# EAGLE design RPI_SSD1963 (EAGLE 6.3)
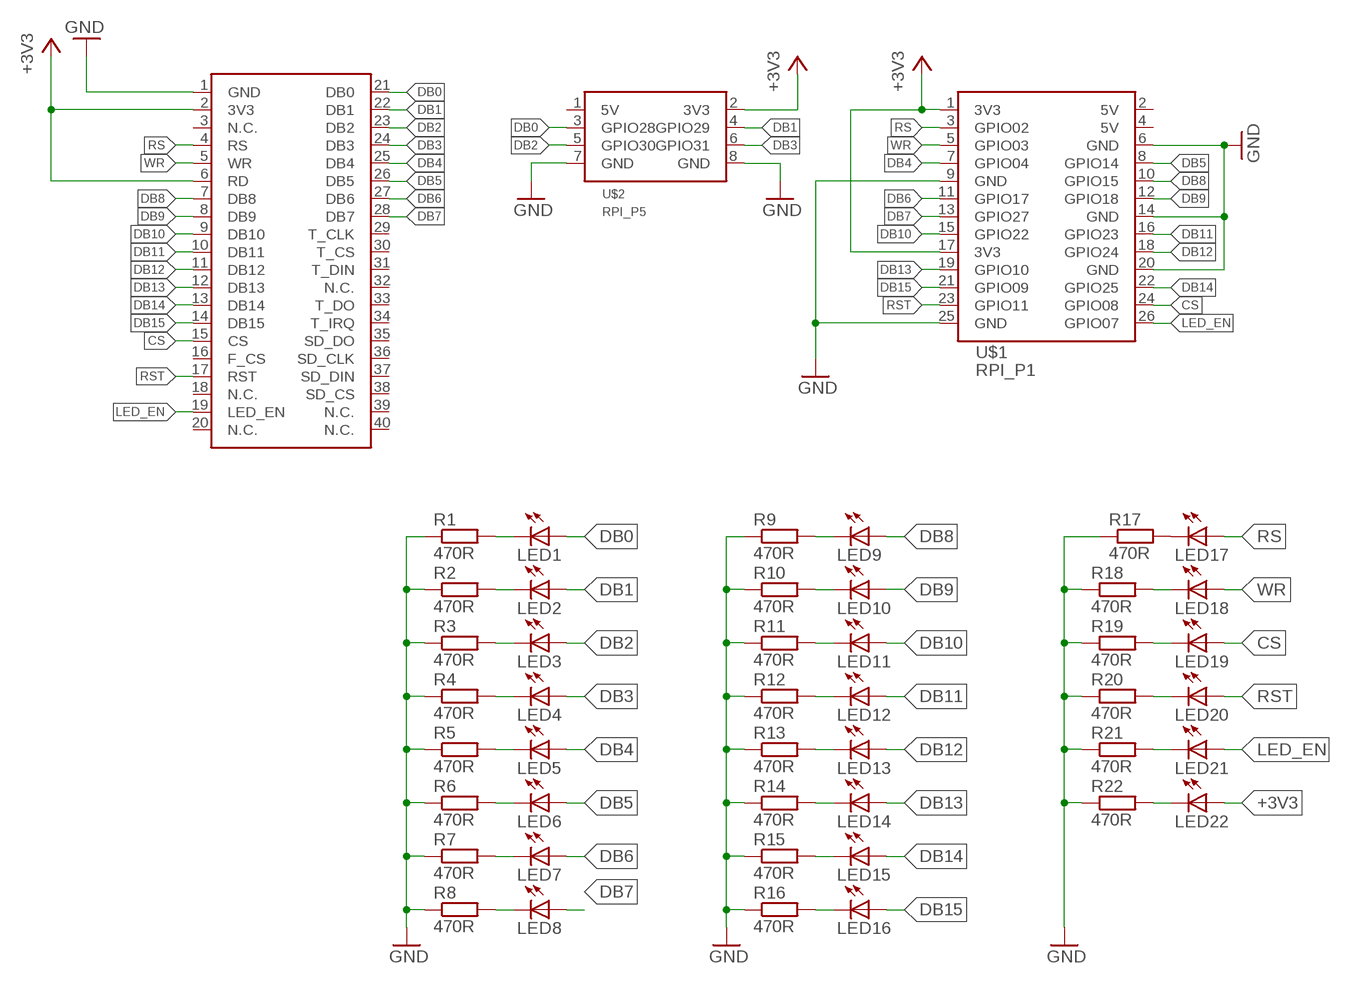
[diagram p0: schematic, sheet 1]

## Parts
LED1  LEDCHIP-LED0603  [CHIP-LED0603]
LED2  LEDCHIP-LED0603  [CHIP-LED0603]
LED3  LEDCHIP-LED0603  [CHIP-LED0603]
LED4  LEDCHIP-LED0603  [CHIP-LED0603]
LED5  LEDCHIP-LED0603  [CHIP-LED0603]
LED6  LEDCHIP-LED0603  [CHIP-LED0603]
LED7  LEDCHIP-LED0603  [CHIP-LED0603]
LED8  LEDCHIP-LED0603  [CHIP-LED0603]
LED9  LEDCHIP-LED0603  [CHIP-LED0603]
LED10  LEDCHIP-LED0603  [CHIP-LED0603]
LED11  LEDCHIP-LED0603  [CHIP-LED0603]
LED12  LEDCHIP-LED0603  [CHIP-LED0603]
LED13  LEDCHIP-LED0603  [CHIP-LED0603]
LED14  LEDCHIP-LED0603  [CHIP-LED0603]
LED15  LEDCHIP-LED0603  [CHIP-LED0603]
LED16  LEDCHIP-LED0603  [CHIP-LED0603]
LED17  LEDCHIP-LED0603  [CHIP-LED0603]
LED18  LEDCHIP-LED0603  [CHIP-LED0603]
LED19  LEDCHIP-LED0603  [CHIP-LED0603]
LED20  LEDCHIP-LED0603  [CHIP-LED0603]
LED21  LEDCHIP-LED0603  [CHIP-LED0603]
LED22  LEDCHIP-LED0603  [CHIP-LED0603]
R1  470R  R-EU_R0402  [R0402]
R2  470R  R-EU_R0402  [R0402]
R3  470R  R-EU_R0402  [R0402]
R4  470R  R-EU_R0402  [R0402]
R5  470R  R-EU_R0402  [R0402]
R6  470R  R-EU_R0402  [R0402]
R7  470R  R-EU_R0402  [R0402]
R8  470R  R-EU_R0402  [R0402]
R9  470R  R-EU_R0402  [R0402]
R10  470R  R-EU_R0402  [R0402]
R11  470R  R-EU_R0402  [R0402]
R12  470R  R-EU_R0402  [R0402]
R13  470R  R-EU_R0402  [R0402]
R14  470R  R-EU_R0402  [R0402]
R15  470R  R-EU_R0402  [R0402]
R16  470R  R-EU_R0402  [R0402]
R17  470R  R-EU_R0402  [R0402]
R18  470R  R-EU_R0402  [R0402]
R19  470R  R-EU_R0402  [R0402]
R20  470R  R-EU_R0402  [R0402]
R21  470R  R-EU_R0402  [R0402]
R22  470R  R-EU_R0402  [R0402]
U$1  RPI_P1  [RPI_P1]
U$2  RPI_P5  [RPI_P5]
U$3  SSD1963  [SSD1963]

## Nets
+3V3: LED22.A U$1.1(3V3) U$1.17(3V3) U$2.2(3V3) U$3.2(3V3) U$3.6(RD)
CS: LED19.A U$1.24(GPIO08) U$3.15(CS)
DB0: LED1.A U$2.3(GPIO28) U$3.21(DB0)
DB1: LED2.A U$2.4(GPIO29) U$3.22(DB1)
DB2: LED3.A U$2.5(GPIO30) U$3.23(DB2)
DB3: LED4.A U$2.6(GPIO31) U$3.24(DB3)
DB4: LED5.A U$1.7(GPIO04) U$3.25(DB4)
DB5: LED6.A U$1.8(GPIO14) U$3.26(DB5)
DB6: LED7.A U$1.11(GPIO17) U$3.27(DB6)
DB7: LED8.A U$1.13(GPIO27) U$3.28(DB7)
DB8: LED9.A U$1.10(GPIO15) U$3.7(DB8)
DB9: LED10.A U$1.12(GPIO18) U$3.8(DB9)
DB10: LED11.A U$1.15(GPIO22) U$3.9(DB10)
DB11: LED12.A U$1.16(GPIO23) U$3.10(DB11)
DB12: LED13.A U$1.18(GPIO24) U$3.11(DB12)
DB13: LED14.A U$1.19(GPIO10) U$3.12(DB13)
DB14: LED15.A U$1.22(GPIO25) U$3.13(DB14)
DB15: LED16.A U$1.21(GPIO09) U$3.14(DB15)
GND: R1.1 R2.1 R3.1 R4.1 R5.1 R6.1 R7.1 R8.1 R9.1 R10.1 R11.1 R12.1 R13.1 R14.1 R15.1 R16.1 R17.1 R18.1 R19.1 R20.1 R21.1 R22.1 U$1.6(GND) U$1.9(GND) U$1.14(GND) U$1.20(GND) U$1.25(GND) U$2.7(GND) U$2.8(GND) U$3.1(GND)
LED_EN: LED21.A U$1.26(GPIO07) U$3.19(LED_EN)
N$1: LED1.C R1.2
N$2: LED2.C R2.2
N$3: LED3.C R3.2
N$4: LED4.C R4.2
N$5: LED5.C R5.2
N$6: LED6.C R6.2
N$7: LED7.C R7.2
N$8: LED8.C R8.2
N$9: LED9.C R9.2
N$10: LED10.C R10.2
N$11: LED11.C R11.2
N$12: LED12.C R12.2
N$13: LED13.C R13.2
N$14: LED14.C R14.2
N$15: LED15.C R15.2
N$16: LED16.C R16.2
N$18: LED17.C R17.2
N$19: LED18.C R18.2
N$20: LED19.C R19.2
N$21: LED20.C R20.2
N$22: LED21.C R21.2
N$23: LED22.C R22.2
RS: LED17.A U$1.3(GPIO02) U$3.4(RS)
RST: LED20.A U$1.23(GPIO11) U$3.17(RST)
WR: LED18.A U$1.5(GPIO03) U$3.5(WR)
Unconnected: U$1.2(5V) U$1.4(5V) U$2.1(5V) U$3.3(N.C.) U$3.16(F_CS) U$3.18(N.C.) U$3.20(N.C.) U$3.29(T_CLK) U$3.30(T_CS) U$3.31(T_DIN) U$3.32(N.C.) U$3.33(T_DO) U$3.34(T_IRQ) U$3.35(SD_DO) U$3.36(SD_CLK) U$3.37(SD_DIN) U$3.38(SD_CS) U$3.39(N.C.) U$3.40(N.C.)

## Library data of the parts
LED1-LED22 = led:LED: LED OSRAM: - CHIPLED LG R971, LG N971, LY N971, LG Q971, LY Q971, LO R971, LY R971 LH N974, LH R974 LS Q976, LO Q976, LY Q976 LO Q996 - Hyper CHIPLED LW Q18S LB Q993, LB Q99A, LB R99A - SideLED LS A670, LO A670, LY A670, LG A670, LP A670 LB A673, LV A673, LT A673, LW A673 LH A674 LY A675 LS A676, LA A676, LO A676, LY A676, LW A676 LS A679, LY A679, LG A679 - Hyper Micro SIDELED® LS Y876, LA Y876, LO Y876, LY Y876 LT Y87S - SmartLED LW L88C, LW L88S LB L89C, LB L89S, LG L890 LS L89K, LO L89K, LY L89K LS L896, LA L896, LO L896, LY L896 - TOPLED LS T670, LO T670, LY T670, LG T670, LP T670 LSG T670, LSP T670, LSY T670, LOP T670, LYG T670 LG T671, LOG T671, LSG T671 LB T673, LV T673, LT T673, LW T673 LH T674 LS T676, LA T676, LO T676, LY T676, LB T676, LH T676, LSB T676, LW T676 LB T67C, LV T67C, LT T67C, LS T67K, LO T67K, LY T67K, LW E67C LS E67B, LA E67B, LO E67B, LY E67B, LB E67C, LV E67C, LT E67C LW T67C LS T679, LY T679, LG T679 LS T770, LO T770, LY T770, LG T770, LP T770 LB T773, LV T773, LT T773, LW T773 LH T774 LS E675, LA E675, LY E675, LS T675 LS T776, LA T776, LO T776, LY T776, LB T776 LHGB T686 LT T68C, LB T68C - Hyper Mini TOPLED® LB M676 - Mini TOPLED Santana® LG M470 LS M47K, LO M47K, LY M47K Source: http://www.osram.convergy.de LUXEON: - LUMILED® LXK2-PW12-R00, LXK2-PW12-S00, LXK2-PW14-U00, LXK2-PW14-V00 LXK2-PM12-R00, LXK2-PM12-S00, LXK2-PM14-U00 LXK2-PE12-Q00, LXK2-PE12-R00, LXK2-PE12-S00, LXK2-PE14-T00, LXK2-PE14-U00 LXK2-PB12-K00, LXK2-PB12-L00, LXK2-PB12-M00, LXK2-PB14-N00, LXK2-PB14-P00, LXK2-PB14-Q00 LXK2-PR12-L00, LXK2-PR12-M00, LXK2-PR14-Q00, LXK2-PR14-R00 LXK2-PD12-Q00, LXK2-PD12-R00, LXK2-PD12-S00 LXK2-PH12-R00, LXK2-PH12-S00 LXK2-PL12-P00, LXK2-PL12-Q00, LXK2-PL12-R00 Source: www.luxeon.com KINGBRIGHT: KA-3528ASYC Source: www.kingbright.com
R1-R22 = rcl:R-EU_: RESISTOR, European symbol
U$1 = raspberryPi:RPI_P1
U$2 = raspberryPi:RPI_P5
U$3 = SSD1963:SSD1963

## Board
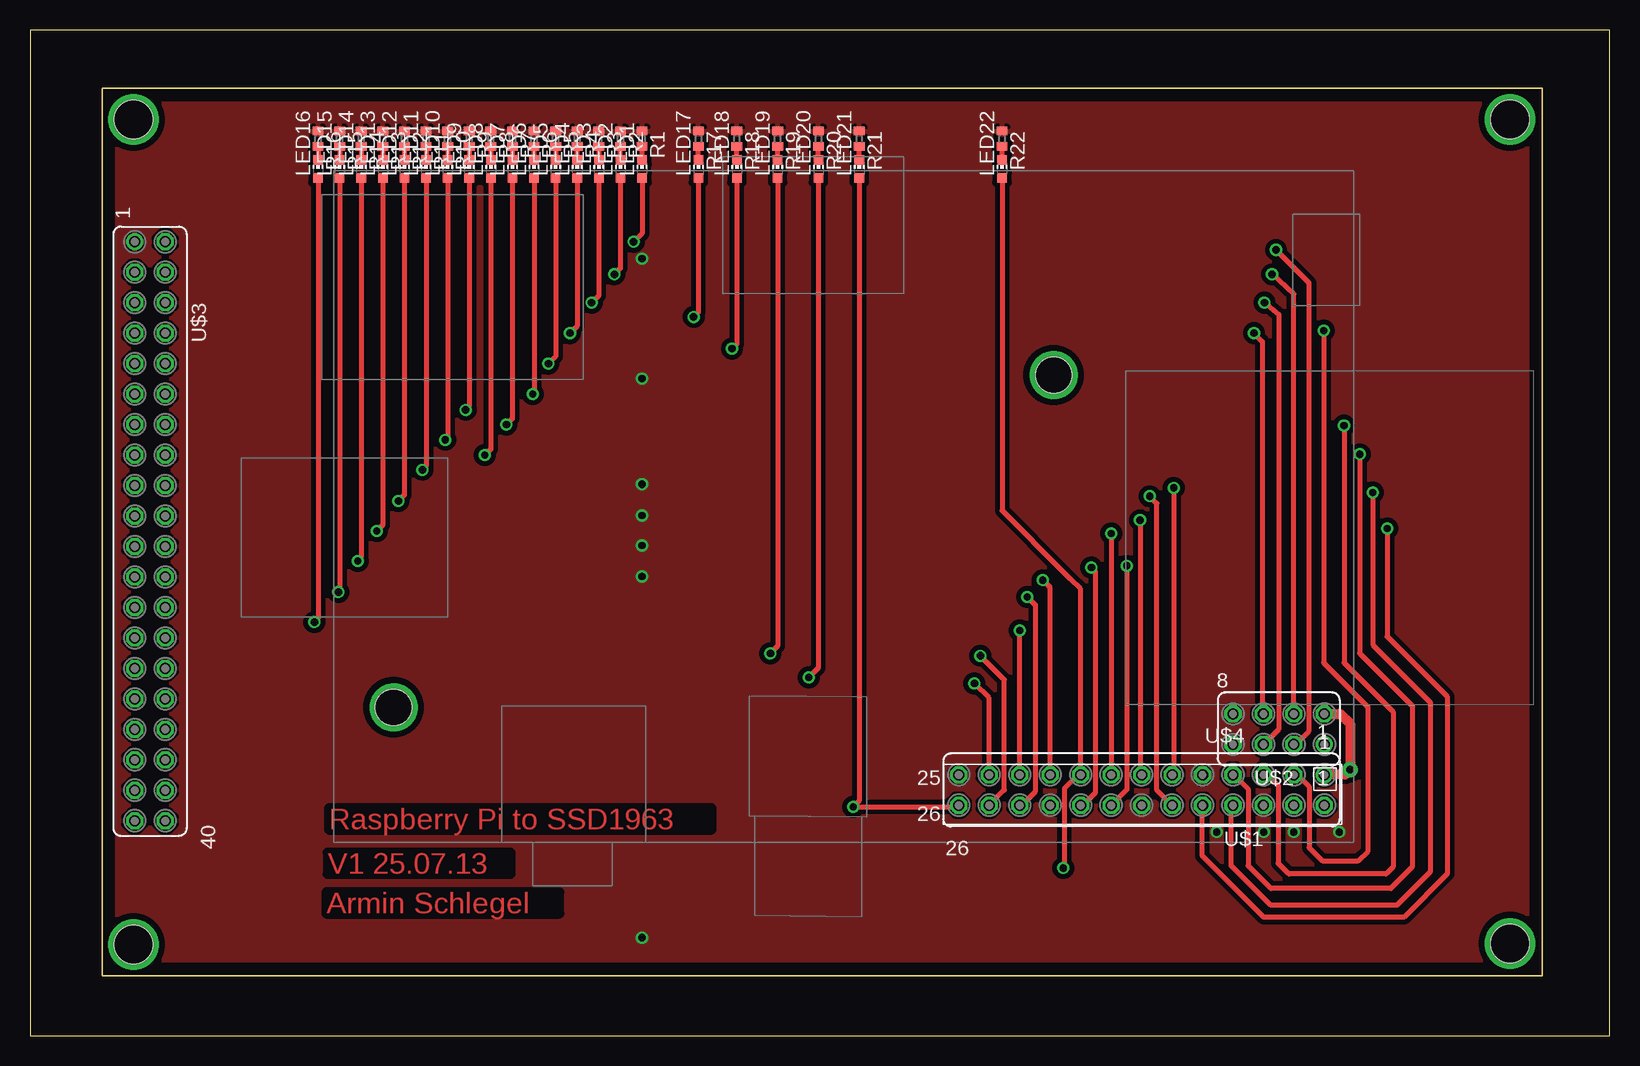
[diagram p1: board, top side]
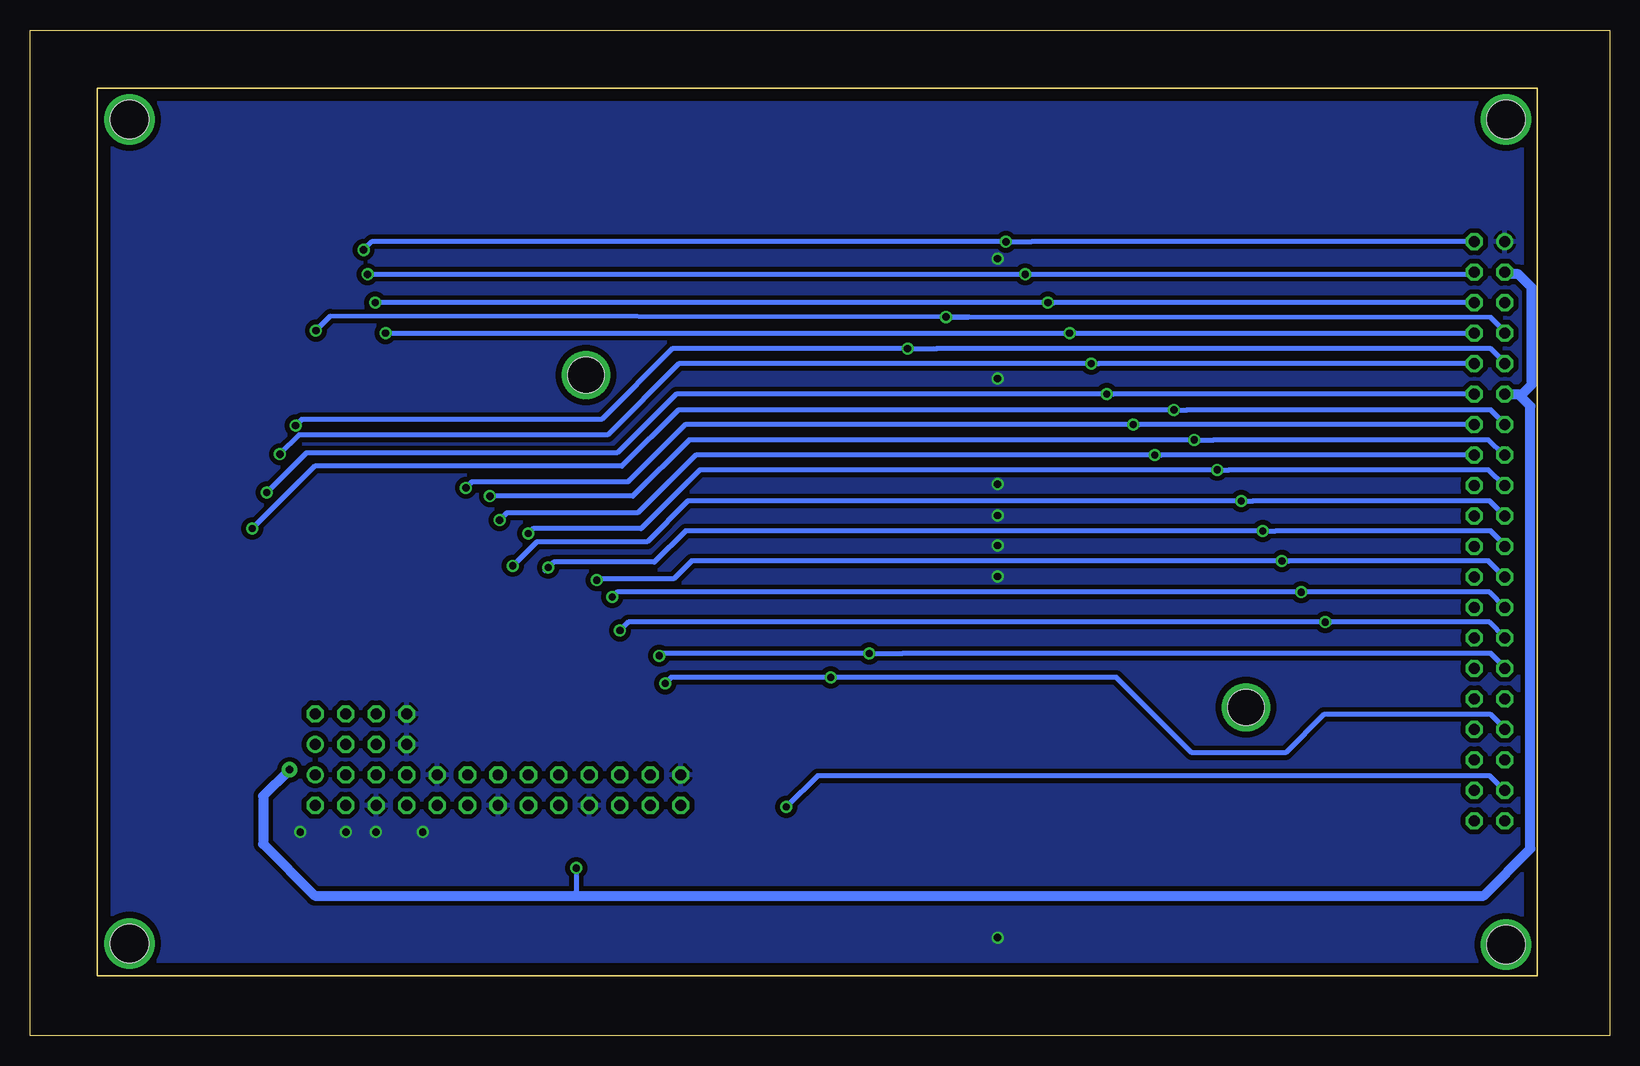
[diagram p2: board, bottom side, seen from below]

Size 131.63 x 83.87 mm. Coordinates in mm from the lower left corner, seen from the top.
Outline: 0,0 131.63,0 131.63,83.87 0,83.87 0,0
Copper layers (1*16): Top 0.035mm / dielectric 1.5mm / Bottom 0.035mm
Design rules "default": minimum track width 10mil, minimum drill 24mil, track to track 8mil, track to pad 8mil, pad to pad 8mil, via to via 8mil, smd to smd 8mil, copper to edge 40mil, drill to drill 8mil, minimum pad ring 10mil, minimum via ring 8mil, stop-mask expansion 4mil, vias tented up to drill 0mil, thermal gap 10mil

### Footprints (pad centres in the part's own frame; a part is rotated, then mirrored left to right if it is on the bottom)
CHIP-LED0603 = smd 0.8 x 0.8: A 0,-0.75; C 0,0.75
R0402 = smd 0.7 x 0.9: 1 -0.65,0; 2 0.65,0
RPI_P1 = drill 0.914: 1 -13.97,-1.27 | drill 0.914 octagon: 2 -13.97,1.27; 3 -11.43,-1.27; 4 -11.43,1.27; 5 -8.89,-1.27; 6 -8.89,1.27; 7 -6.35,-1.27; 8 -6.35,1.27; 9 -3.81,-1.27; 10 -3.81,1.27; 11 -1.27,-1.27; 12 -1.27,1.27; 13 1.27,-1.27; 14 1.27,1.27; 15 3.81,-1.27; 16 3.81,1.27; 17 6.35,-1.27; 18 6.35,1.27; 19 8.89,-1.27; 20 8.89,1.27; 21 11.43,-1.27; 22 11.43,1.27; 23 13.97,-1.27; 24 13.97,1.27; 25 16.51,-1.27; 26 16.51,1.27
RPI_P5 = drill 0.914: 1 -3.81,1.27 | drill 0.914 octagon: 2 -3.81,-1.27; 3 -1.27,1.27; 4 -1.27,-1.27; 5 1.27,1.27; 6 1.27,-1.27; 7 3.81,1.27; 8 3.81,-1.27
SSD1963 = drill 0.914: 1 2.7,61.19 | drill 0.914 octagon: 2 2.7,58.65; 3 2.7,56.11; 4 2.7,53.57; 5 2.7,51.03; 6 2.7,48.49; 7 2.7,45.95; 8 2.7,43.41; 9 2.7,40.87; 10 2.7,38.33; 11 2.7,35.79; 12 2.7,33.25; 13 2.7,30.71; 14 2.7,28.17; 15 2.7,25.63; 16 2.7,23.09; 17 2.7,20.55; 18 2.7,18.01; 19 2.7,15.47; 20 2.7,12.93; 21 5.24,61.19; 22 5.24,58.65; 23 5.24,56.11; 24 5.24,53.57; 25 5.24,51.03; 26 5.24,48.49; 27 5.24,45.95; 28 5.24,43.41; 29 5.24,40.87; 30 5.24,38.33; 31 5.24,35.79; 32 5.24,33.25; 33 5.24,30.71; 34 5.24,28.17; 35 5.24,25.63; 36 5.24,23.09; 37 5.24,20.55; 38 5.24,18.01; 39 5.24,15.47; 40 5.24,12.93 | drill 3.2: P$1 2.6,71.4; P$2 2.6,2.6; P$3 117.3,2.7; P$4 117.3,71.4 | hole 3.2: 117.3,71.4; 117.3,2.7; 2.6,2.6; 2.6,71.4
RASP_OUTLINE = drill 3: P$1 -19.3,-12.1; P$2 35.7,15.6 | hole 3: 35.7,15.6; -19.3,-12.1

### Placement (x,y rotation side)
LED1  51,72.3 0 top
LED2  49.2,72.3 0 top
LED3  47.4,72.3 0 top
LED4  45.6,72.3 0 top
LED5  43.8,72.3 0 top
LED6  42,72.3 0 top
LED7  40.2,72.3 0 top
LED8  38.4,72.3 0 top
LED9  36.6,72.3 0 top
LED10  34.8,72.3 0 top
LED11  33,72.3 0 top
LED12  31.2,72.3 0 top
LED13  29.4,72.3 0 top
LED14  27.6,72.3 0 top
LED15  25.8,72.3 0 top
LED16  24,72.3 0 top
LED17  55.7,72.3 0 top
LED18  58.9,72.3 0 top
LED19  62.3,72.3 0 top
LED20  65.7,72.3 0 top
LED21  69.1,72.3 0 top
LED22  81,72.3 0 top
R1  51,74.8 270 top
R2  49.2,74.8 270 top
R3  47.4,74.8 270 top
R4  45.6,74.8 270 top
R5  43.8,74.8 270 top
R6  42,74.8 270 top
R7  40.2,74.8 270 top
R8  38.4,74.8 270 top
R9  36.6,74.8 270 top
R10  34.8,74.8 270 top
R11  33,74.8 270 top
R12  31.2,74.8 270 top
R13  29.4,74.8 270 top
R14  27.6,74.8 270 top
R15  25.8,74.8 270 top
R16  24,74.8 270 top
R17  55.7,74.8 270 top
R18  58.9,74.8 270 top
R19  62.3,74.8 270 top
R20  65.7,74.8 270 top
R21  69.1,74.8 270 top
R22  81,74.8 270 top
U$1  93.9,20.51 180 top
U$2  104.06,25.59 180 top
U$3  6.03,5.02 0 top
U$4  RPI_OUTLINE  [RASP_OUTLINE]  66,43 180 top

### Tracks (layer width: path | path; a pad name or v marks a point on that pad's centre or on a via)
+3V3  (via drill 0.6, 0.6 pad 1.27)
  Top 0.406: v86.1,14 86.2,14.1 86.2,20.6 87.38,21.78 U$1.17 87.55,37.25 86.7,38.1 86.1,38.7 81,43.8 LED22.A
  Top 0.813: U$2.2 109.14,26.86 110,26 v110,22.2 109.6,21.8 107.89,21.8 U$1.1
  Bottom 0.406: 7.6,53.51 7.39,53.51 | v86.1,14 86.1,11.8 86.2,11.7
  Bottom 0.813: U$3.6 7.6,53.51 6.6,52.51 6.6,15.6 10.5,11.7 86.2,11.7 107.9,11.7 112.2,16 112.2,20 v110,22.2 | 7.39,53.51 7.29,53.51 6.5,54.3 6.5,62.4 7.6,63.5 8.56,63.5 U$3.2
CS  (via drill 0.6)
  Top 0.406: U$1.24 81.2,20.5 81.2,29.7 v79.2,31.7 | LED19.A 62.3,32.5 v61.7,31.9
  Bottom 0.406: U$3.15 8.73,30.73 9.9,31.9 58.9,31.9 v61.7,31.9 79,31.9 v79.2,31.7
DB0  (via drill 0.6)
  Top 0.406: U$2.3 105.46,24.32 106.58,25.45 106.58,62.78 v103.83,65.53 | LED1.A 51,66.91 v50.3,66.21
  Bottom 0.406: U$3.21 48.2,66.21 v50.3,66.21 103.16,66.21 v103.83,65.53
DB1  (via drill 0.6)
  Top 0.406: U$2.4 105.33,61.87 v103.5,63.5 | LED2.A 49.2,64 v48.7,63.5
  Bottom 0.406: v103.5,63.5 v48.7,63.5 48.2,63.5 11.44,63.5 U$3.22
DB2  (via drill 0.6)
  Top 0.406: U$2.5 102.82,24.32 104.1,25.6 104.1,60.1 v102.87,61.13 | LED3.A 47.4,61.73 v46.8,61.13
  Bottom 0.406: U$3.23 46.3,61.13 v46.8,61.13 v102.87,61.13
DB3  (via drill 0.6)
  Top 0.406: v102,58.6 102.69,57.91 102.69,26.96 U$2.6 | LED4.A 45.6,59.2 v45,58.6
  Bottom 0.406: v102,58.6 v45,58.6 44.5,58.6 U$3.24
DB4  (via drill 0.6)
  Top 0.406: v110.8,48.5 110.8,31.9 115.2,27.5 115.2,14.1 113.4,12.3 103.4,12.3 101.5,14.2 101.5,20.6 100.32,21.78 U$1.7 | LED5.A 43.8,56.65 v43.2,56.05
  Bottom 0.406: U$3.25 42.6,56.05 v43.2,56.05 77.55,56.05 83.5,50.1 109.2,50.1 v110.8,48.5
DB5  (via drill 0.6)
  Top 0.406: v111.9,45.3 111.9,32.6 116.7,27.8 116.7,13.7 113.9,10.9 103.4,10.9 100.1,14.2 100.1,19.09 U$1.8 | LED6.A 42,53.61 v41.9,53.51
  Bottom 0.406: U$3.26 41.4,53.51 v41.9,53.51 77.79,53.51 82.7,48.6 108.6,48.6 v111.9,45.3
DB6  (via drill 0.6)
  Top 0.406: v95.3,45.7 95.3,21.91 U$1.11 | LED7.A 40.2,51.47 v39.7,50.97
  Bottom 0.406: U$3.27 39.2,50.97 v39.7,50.97 77.03,50.97 81.8,46.2 94.8,46.2 v95.3,45.7
DB7  (via drill 0.6)
  Top 0.406: v92.5,43 92.5,21.91 U$1.13 | LED8.A 38.4,48.93 v37.9,48.43
  Bottom 0.406: U$3.28 37.4,48.43 v37.9,48.43 76.17,48.43 81,43.6 91.9,43.6 v92.5,43
DB8  (via drill 0.6)
  Top 0.406: v113.1,42.3 113.1,33.3 118.1,28.3 118.1,13.5 114.5,9.9 102.8,9.9 97.7,15 U$1.10 | LED9.A 36.6,52.5 v36.3,52.2
  Bottom 0.406: U$3.7 8.73,51.03 9.9,52.2 35.2,52.2 v36.3,52.2 77.6,52.2 82.3,47.5 107.9,47.5 v113.1,42.3
DB9  (via drill 0.6)
  Top 0.406: v93.3,45 93.9,44.4 93.9,20.5 95.03,19.37 95.17,19.37 U$1.12 | LED10.A 34.8,49.9 v34.6,49.7
  Bottom 0.406: U$3.8 8.83,48.43 10.1,49.7 33,49.7 v34.6,49.7 76.7,49.7 81.4,45 v93.3,45
DB10  (via drill 0.6)
  Top 0.406: v90.1,41.9 U$1.15 | LED11.A 33,47.5 v32.7,47.2
  Bottom 0.406: U$3.9 8.79,45.89 10.1,47.2 31.7,47.2 v32.7,47.2 75.8,47.2 80.7,42.3 89.7,42.3 v90.1,41.9
DB11  (via drill 0.6)
  Top 0.406: v91.4,39.2 91.4,20.55 U$1.16 | LED12.A 31.2,45.1 v30.7,44.6
  Bottom 0.406: U$3.10 8.75,43.35 10,44.6 29.7,44.6 v30.7,44.6 76.8,44.6 80.2,41.2 89.4,41.2 v91.4,39.2
DB12  (via drill 0.6)
  Top 0.406: U$1.18 87.74,19.24 88.8,20.3 88.8,38.7 v88.45,39.05 | LED13.A 29.4,42.6 v28.9,42.1
  Bottom 0.406: U$3.11 8.73,40.93 9.9,42.1 27.8,42.1 v28.9,42.1 77,42.1 79.6,39.5 88,39.5 v88.45,39.05 88.7,38.8
DB13  (via drill 0.6)
  Top 0.406: U$1.19 85.01,37.39 v84.4,38 | LED14.A 27.6,39.9 v27.3,39.6
  Bottom 0.406: U$3.12 8.77,38.27 10.1,39.6 26.7,39.6 v27.3,39.6 76.5,39.6 78,38.1 84.3,38.1 v84.4,38
DB14  (via drill 0.6)
  Top 0.406: U$1.22 82.64,19.24 83.8,20.4 83.8,35.9 v83.1,36.6 | LED15.A 25.8,37.1 v25.7,37
  Bottom 0.406: U$3.13 10,37 v25.7,37 82.7,37 v83.1,36.6
DB15  (via drill 0.6)
  Top 0.406: U$1.21 v82.47,33.8 | LED16.A 24,34.8 v23.7,34.5
  Bottom 0.406: U$3.14 8.73,33.23 10,34.5 23.2,34.5 v23.7,34.5 81.77,34.5 v82.47,33.8
GND  (via drill 0.6)
  Bottom 0.406: U$3.1 8.73,66.17
  other vias: 51,38.3 51,40.9 51,43.4 51,46 51,54.8 51,64.8 51,8.2 102.8,17 109.1,17 98.9,17 105.3,17
  pour Bottom (isolate 0.406): 6,79 126.1,79 126.1,5 6,5
  pour Top (isolate 0.406): 6,79 126,79 126,5 6,5
LED_EN  (via drill 0.6)
  Top 0.406: U$1.26 77.25,19.1 v68.6,19.1 69.1,19.6 LED21.A
  Bottom 0.406: U$3.19 8.79,20.49 10,21.7 66,21.7 v68.6,19.1
N$1
  Top 0.406: LED1.C R1.2
N$2
  Top 0.406: LED2.C R2.2
N$3
  Top 0.406: R3.2 LED3.C
N$4
  Top 0.406: LED4.C R4.2
N$5
  Top 0.406: R5.2 LED5.C
N$6
  Top 0.406: LED6.C R6.2
N$7
  Top 0.406: R7.2 LED7.C
N$8
  Top 0.406: R8.2 LED8.C
N$9
  Top 0.406: R9.2 LED9.C
N$10
  Top 0.406: R10.2 LED10.C
N$11
  Top 0.406: R11.2 LED11.C
N$12
  Top 0.406: R12.2 LED12.C
N$13
  Top 0.406: R13.2 LED13.C
N$14
  Top 0.406: R14.2 LED14.C
N$15
  Top 0.406: R15.2 LED15.C
N$16
  Top 0.406: R16.2 LED16.C
N$18
  Top 0.406: LED17.C R17.2
N$19
  Top 0.406: LED18.C R18.2
N$20
  Top 0.406: LED19.C R19.2
N$21
  Top 0.406: LED20.C R20.2
N$22
  Top 0.406: LED21.C R21.2
N$23
  Top 0.406: LED22.C R22.2
RS  (via drill 0.6)
  Top 0.406: v107.8,58.8 107.8,31.1 111.5,27.4 111.5,15.4 110.7,14.6 107.7,14.6 106.6,15.7 106.6,20.8 105.62,21.78 U$1.3 | LED17.A 55.7,60.35 v55.3,59.95
  Bottom 0.406: U$3.4 8.73,58.73 9.9,59.9 53.4,59.95 | 53.4,59.95 v55.3,59.95 | v55.3,59.95 106.6,60 v107.8,58.8 | v55.3,59.95 53.4,59.95
RST  (via drill 0.6)
  Top 0.406: U$1.23 79.93,28.17 v78.7,29.4 | LED20.A 65.7,30.7 v64.9,29.9
  Bottom 0.406: U$3.17 8.73,25.63 9.9,26.8 23.8,26.8 27,23.6 34.8,23.6 41.1,29.9 64.4,29.9 v64.9,29.9 78.2,29.9 v78.7,29.4
WR  (via drill 0.6)
  Top 0.406: v109.5,50.9 109.5,31.1 113.6,27 113.6,14.1 113,13.5 104.9,13.5 104,14.4 104,20.9 103.12,21.78 U$1.5 | LED18.A 58.9,57.7 v58.5,57.3
  Bottom 0.406: U$3.5 8.73,56.13 9.9,57.3 56.1,57.3 v58.5,57.3 78.1,57.3 84,51.4 109,51.4 v109.5,50.9

### Text on the board
Top: Raspberry Pi to SSD1963 | V1 25.07.13 | Armin Schlegel